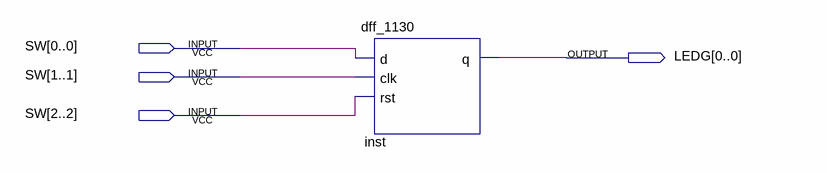
[diagram p0: schematic sheet]
// Quartus schematic dff_test.bdf as structural Verilog: 1 symbols, 4 pins
module dff_test (
  input  [2:0] SW,
  output [0:0] LEDG
);

  dff_1130 inst (.d(SW[0]), .clk(SW[1]), .rst(SW[2]), .q(LEDG[0]));
endmodule
